# EasyEDA Pro project ProPrj_红外巡线_2025-09-12.epro

# Schematic Schematic1
Board Name: Board1; Create Date: 2025-05-07; Page Name: P1; Project Name: 红外巡线; Schematic Name: Schematic1; Update Date: 2025-05-07; Company: 嘉立创EDA; Page Size: A4; Version: V1.0
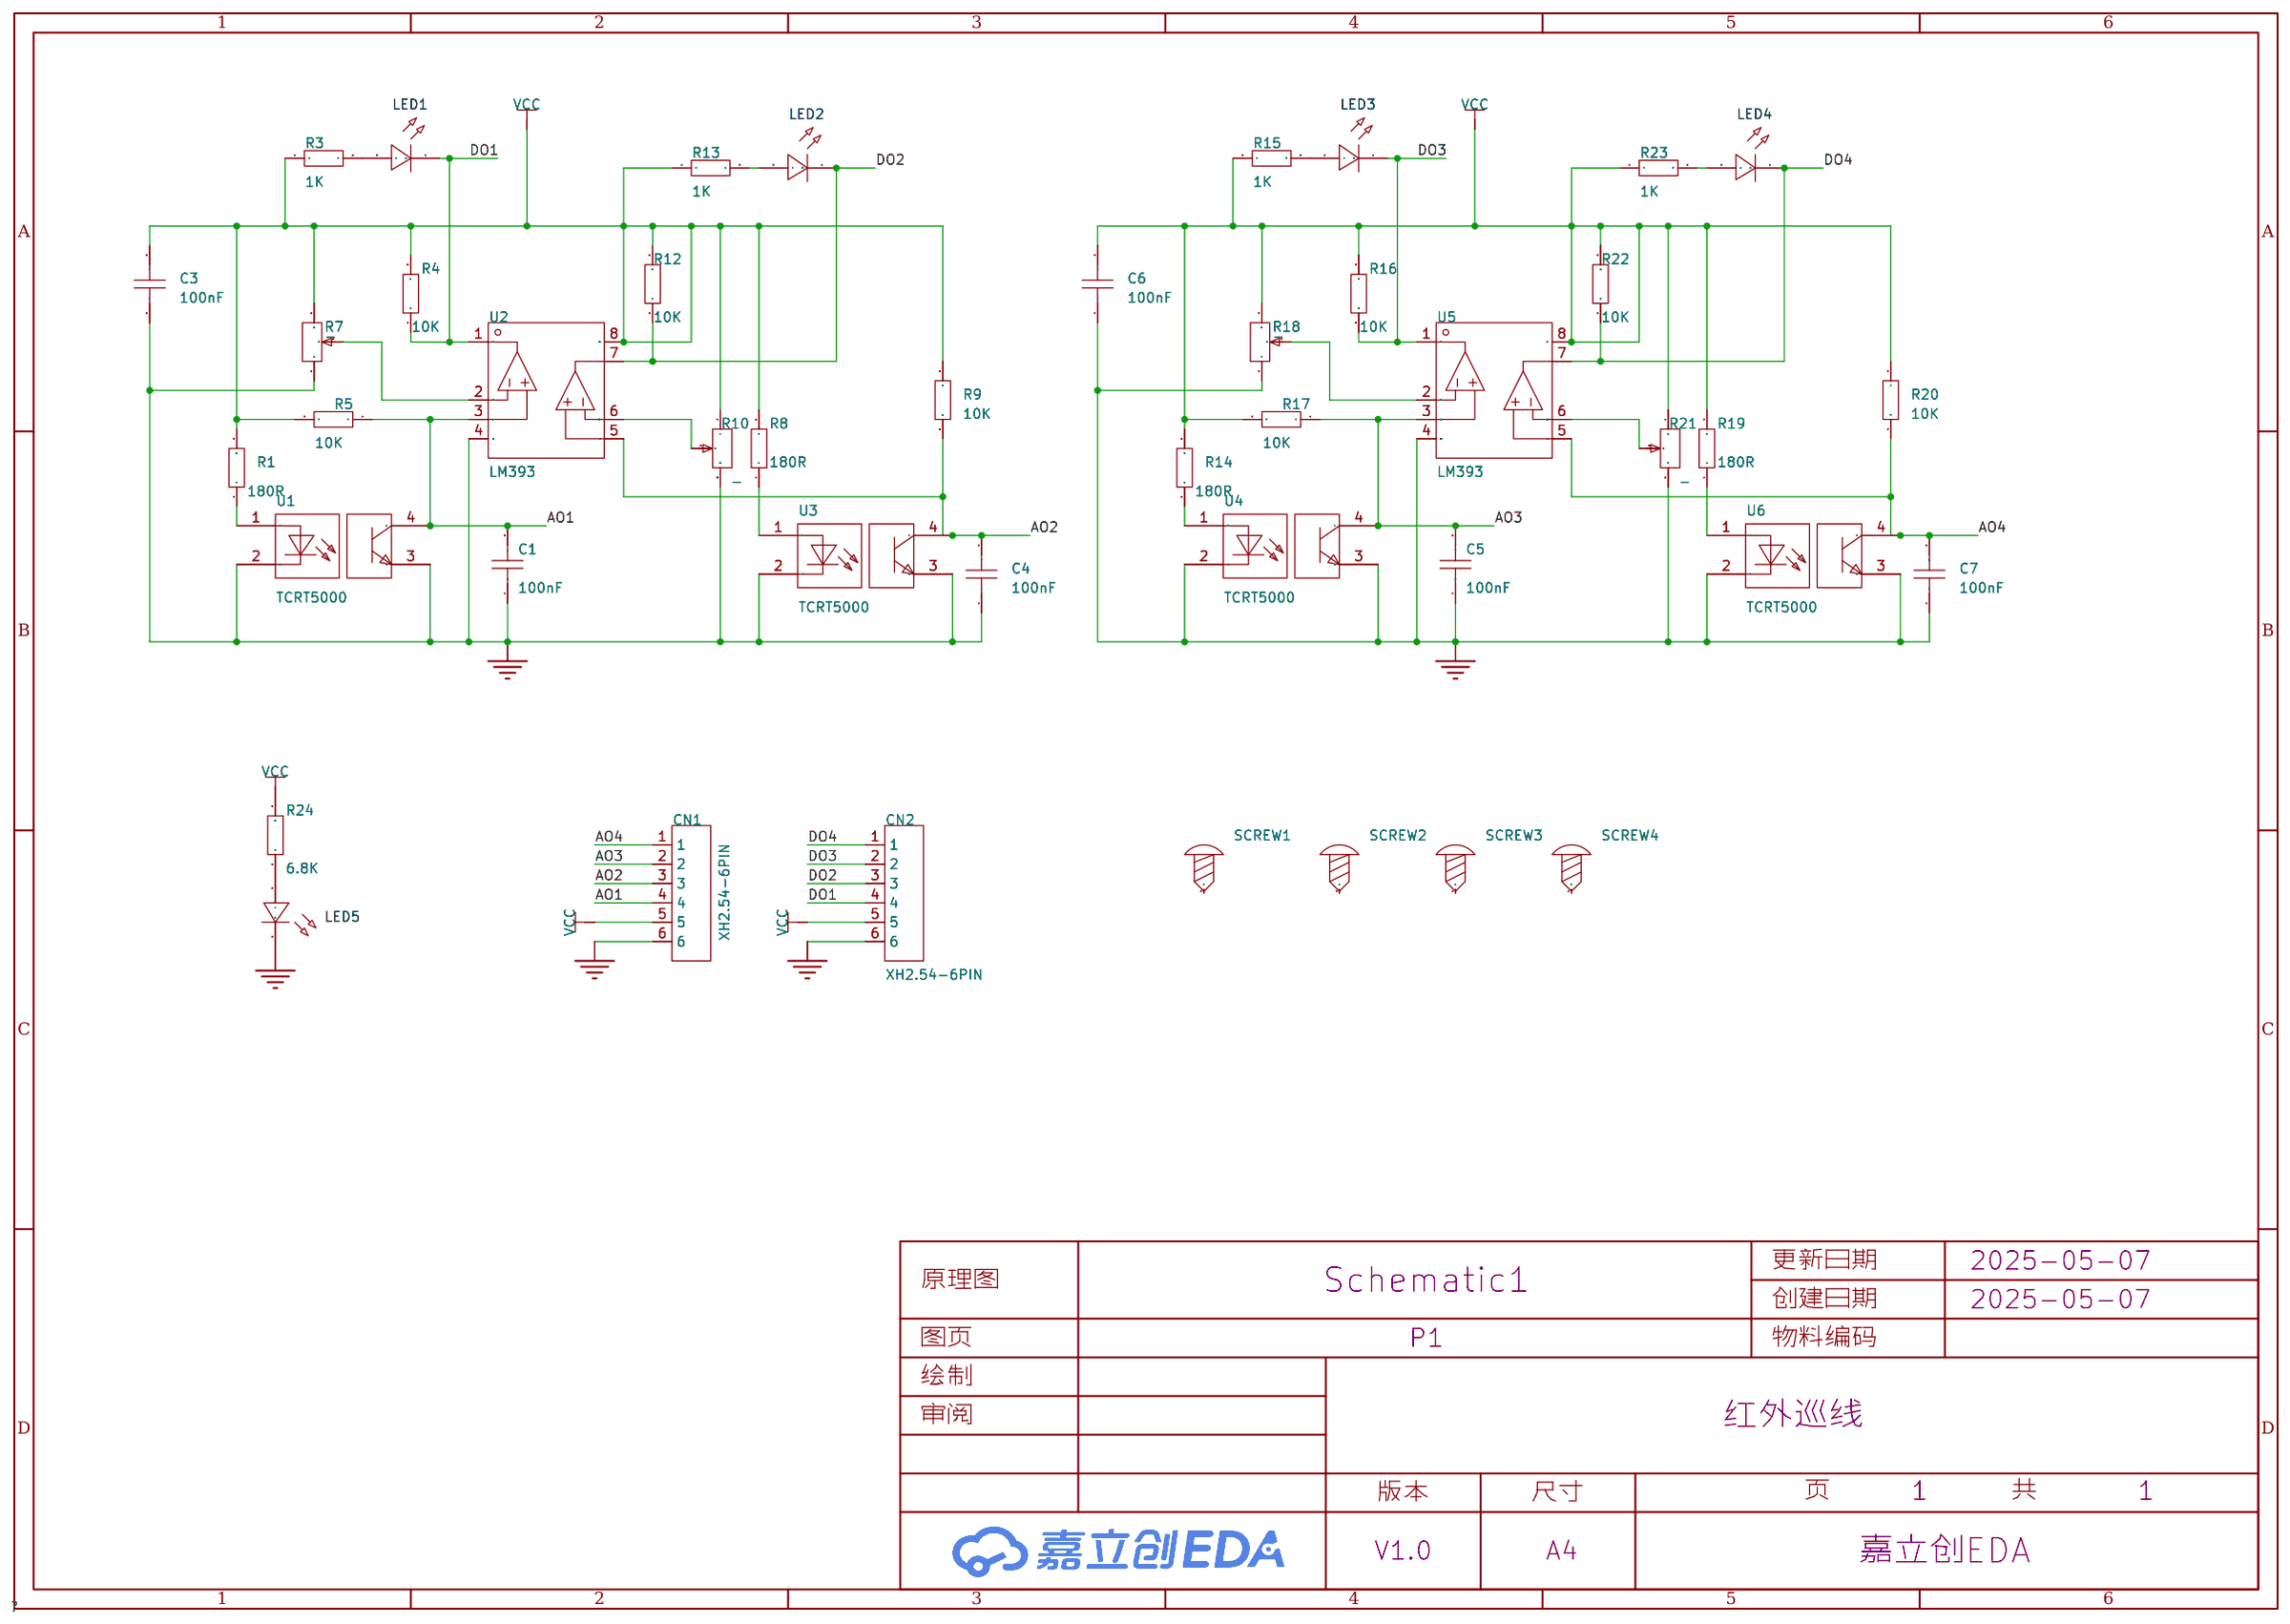
[diagram p0: schematic sheet]

## Parts
C1  100nF  [C0603]
C3  100nF  [C0603]
C4  100nF  [C0603]
C5  100nF  [C0603]
C6  100nF  [C0603]
C7  100nF  [C0603]
CN1  XH2.54-6PIN  [CONN-TH_6P-P2.50-V-M_753]
CN2  XH2.54-6PIN  [CONN-TH_6P-P2.50-V-M_753]
LED1  -  [LED_0805]
LED2  -  [LED_0805]
LED3  -  [LED_0805]
LED4  -  [LED_0805]
LED5  -  [LED_0805]
R1  180R  [R0805]
R3  1K  [R0805]
R4  10K  [R0805]
R5  10K  [R0805]
R7  -  [RES-ADJ-TH_3362P]
R8  180R  [R0805]
R9  10K  [R0805]
R10  -  [RES-ADJ-TH_3362P]
R12  10K  [R0805]
R13  1K  [R0805]
R14  180R  [R0805]
R15  1K  [R0805]
R16  10K  [R0805]
R17  10K  [R0805]
R18  -  [RES-ADJ-TH_3362P]
R19  180R  [R0805]
R20  10K  [R0805]
R21  -  [RES-ADJ-TH_3362P]
R22  10K  [R0805]
R23  1K  [R0805]
R24  6.8K  [R0805]
SCREW1  -  [M3螺丝]
SCREW2  -  [M3螺丝]
SCREW3  -  [M3螺丝]
SCREW4  -  [M3螺丝]
U1  TCRT5000  [OPTO-TH_TCRT5000]
U2  LM393  [SOP-8_L4.9-W3.9-P1.27-LS6.0-BL]
U3  TCRT5000  [OPTO-TH_TCRT5000]
U4  TCRT5000  [OPTO-TH_TCRT5000]
U5  LM393  [SOP-8_L4.9-W3.9-P1.27-LS6.0-BL]
U6  TCRT5000  [OPTO-TH_TCRT5000]

## Library data of the parts
C1 C3-C7 = CAP_0603: Supplier Footprint: 0603
CN1 CN2 = XH2.54-6PIN: Supplier Part: C9900014920; Supplier Footprint: JP6; JLCPCB Part Class: 扩展库; Supplier: LCSC
LED1-LED5 = LED_0805-G: Supplier Footprint: 0805
R1 R3-R5 R8 R9 R12-R17 R19 R20 R22-R24 = Res_0805: Supplier Footprint: 0805
R7 R10 R18 R21 = 3362P-1-103_C5047: 阻值:-;功率:-;; LCSC Part Name: 10KΩ; Supplier Part: C5047; Manufacturer Part: 3362P-1-103; Supplier Footprint: 3362P; Supplier: LCSC
SCREW1-SCREW4 = M3螺丝: Supplier Footprint: 插件
U1 U3 U4 U6 = TCRT5000: 感应距离:15mm;集电极电流(最大值):100mA;; Supplier Part: C2984661; Manufacturer: VISHAY(威世); Supplier Footprint: DIP-4; JLCPCB Part Class: 扩展库; Datasheet: https://atta.szlcsc.com/upload/public/pdf/source/20220524/56309200CFD992CFE90087BA59F1182D.pdf; Supplier: LCSC; Sensing Distance: 15mm; Collector Current (Max): 100mA
U2 U5 = LM393: Supplier Part: C504553; Supplier Footprint: SOP-8; Datasheet: https://atta.szlcsc.com/upload/public/pdf/source/20230406/A70798E4E4EECBB4A1C89323107B7C74.pdf; Supplier: LCSC

## Nets
GND: C1.1 C3.1 C4.1 C5.1 C6.1 C7.1 CN1.6 CN2.6 LED5.1(C) R7.1 R10.3 R18.1 R21.3 U1.2 U1.3 U2.4(GND) U3.2 U3.3 U4.2 U4.3 U5.4(GND) U6.2 U6.3
VCC: C3.2 C6.2 CN1.5 CN2.5 R1.2 R3.1 R4.2 R5.2 R7.3 R8.2 R9.1 R10.1 R12.2 R13.1 R14.2 R15.1 R16.2 R17.2 R18.3 R19.2 R20.1 R21.1 R22.2 R23.1 R24.2 U2.8(VDD) U5.8(VDD)
AO1: C1.2 CN1.4 R5.1 U1.4 U2.3
AO2: C4.2 CN1.3 R9.2 U2.5 U3.4
AO3: C5.2 CN1.2 R17.1 U4.4 U5.3
AO4: C7.2 CN1.1 R20.2 U5.5 U6.4
DO1: CN2.4 LED1.1(C) R4.1 U2.1
DO2: CN2.3 LED2.1(C) R12.1 U2.7
DO3: CN2.2 LED3.1(C) R16.1 U5.1
DO4: CN2.1 LED4.1(C) R22.1 U5.7
$1N605: R1.1 U1.1
$1N989: LED1.2(A) R3.2
$1N1449: LED2.2(A) R13.2
$1N1532: R8.1 U3.1
$1N2609: LED3.2(A) R15.2
$1N2632: R14.1 U4.1
$1N2644: LED4.2(A) R23.2
$1N2646: R19.1 U6.1
Net-(LED5-2): LED5.2(A) R24.1
Net-(R7-2): R7.2 U2.2
Net-(R10-2): R10.2 U2.6
Net-(R18-2): R18.2 U5.2
Net-(R21-2): R21.2 U5.6

Not connected (* = marked no-connect by the designer): SCREW1 1; SCREW2 1; SCREW3 1; SCREW4 1

# Schematic Schematic1_1
Board Name: Board1_1; Create Date: 2025-07-24; Page Name: P1; Project Name: 红外巡线; Schematic Name: Schematic1_1; Update Date: 2025-07-24; Company: 嘉立创EDA; Page Size: A4; Version: V1.0
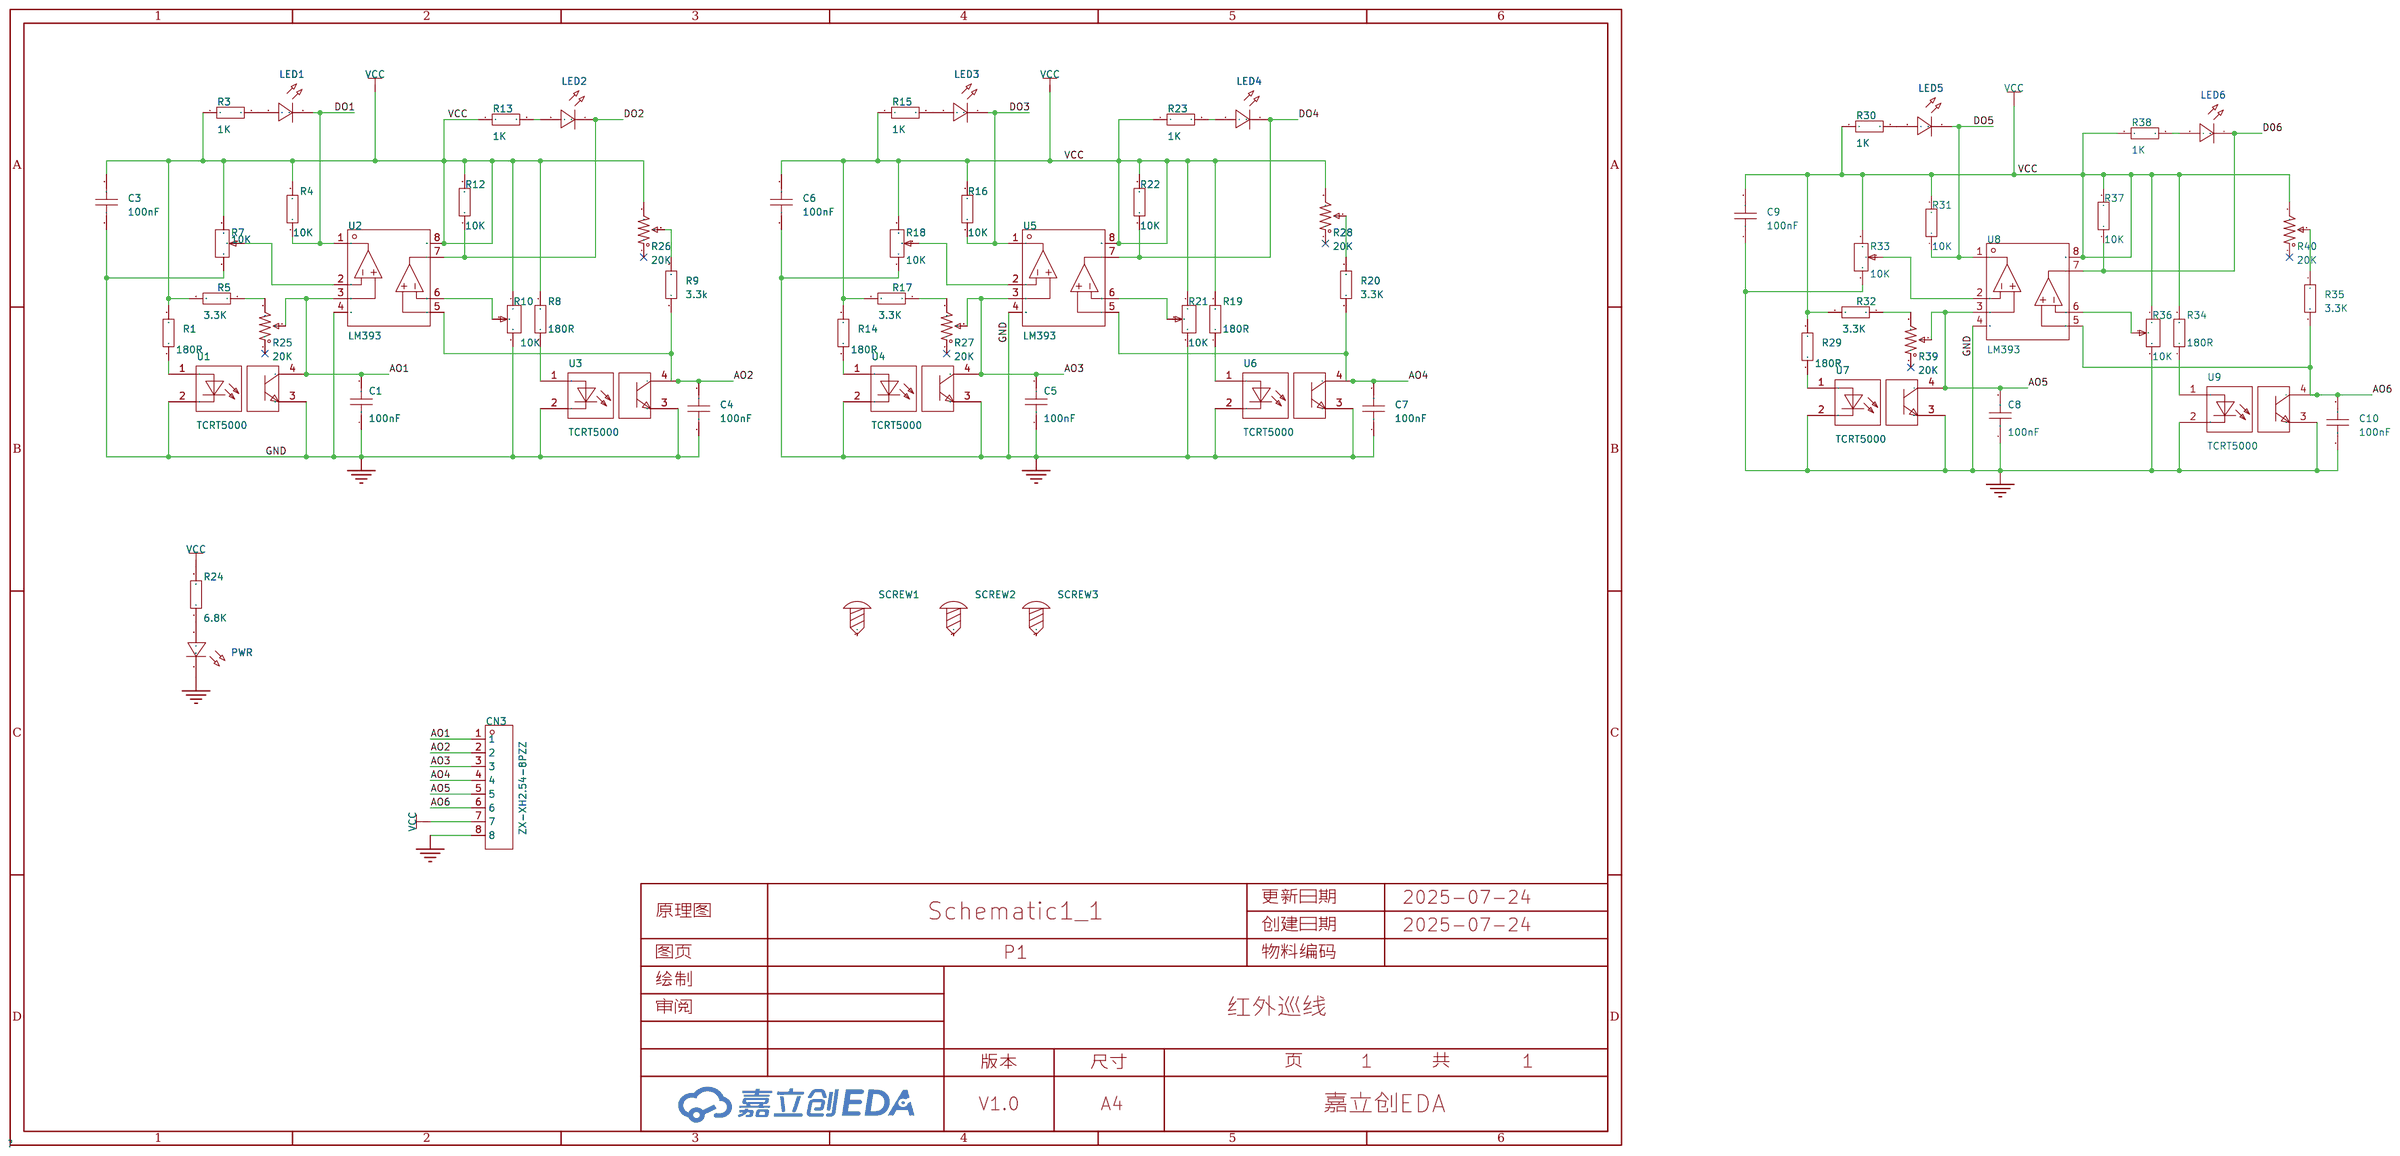
[diagram p1: schematic sheet]

## Parts
C1  100nF  [C0603]
C3  100nF  [C0603]
C4  100nF  [C0603]
C5  100nF  [C0603]
C6  100nF  [C0603]
C7  100nF  [C0603]
C8  100nF  [C0603]
C9  100nF  [C0603]
C10  100nF  [C0603]
CN3  ZX-XH2.54-8PZZ  [CONN-TH_8P-P2.50-XH2.54-8P]
LED1  -  [LED_0805]
LED2  -  [LED_0805]
LED3  -  [LED_0805]
LED4  -  [LED_0805]
LED5  -  [LED_0805]
LED6  -  [LED_0805]
PWR  -  [LED_0805]
R1  180R  [R0805]
R3  1K  [R0805]
R4  10K  [R0805]
R5  3.3K  [R0805]
R7  10K  [RES-ADJ-TH_3362P]
R8  180R  [R0805]
R9  3.3k  [R0805]
R10  10K  [RES-ADJ-TH_3362P]
R12  10K  [R0805]
R13  1K  [R0805]
R14  180R  [R0805]
R15  1K  [R0805]
R16  10K  [R0805]
R17  3.3K  [R0805]
R18  10K  [RES-ADJ-TH_3362P]
R19  180R  [R0805]
R20  3.3K  [R0805]
R21  10K  [RES-ADJ-TH_3362P]
R22  10K  [R0805]
R23  1K  [R0805]
R24  6.8K  [R0805]
R25  20K  [RES-ADJ-TH_3P-L10.0-W10.0-P2.50-L]
R26  20K  [RES-ADJ-TH_3P-L10.0-W10.0-P2.50-L]
R27  20K  [RES-ADJ-TH_3P-L10.0-W10.0-P2.50-L]
R28  20K  [RES-ADJ-TH_3P-L10.0-W10.0-P2.50-L]
R29  180R  [R0805]
R30  1K  [R0805]
R31  10K  [R0805]
R32  3.3K  [R0805]
R33  10K  [RES-ADJ-TH_3362P]
R34  180R  [R0805]
R35  3.3K  [R0805]
R36  10K  [RES-ADJ-TH_3362P]
R37  10K  [R0805]
R38  1K  [R0805]
R39  20K  [RES-ADJ-TH_3P-L10.0-W10.0-P2.50-L]
R40  20K  [RES-ADJ-TH_3P-L10.0-W10.0-P2.50-L]
SCREW1  -  [M3螺丝]
SCREW2  -  [M3螺丝]
SCREW3  -  [M3螺丝]
U1  TCRT5000  [OPTO-TH_TCRT5000]
U2  LM393  [SOP-8_L4.9-W3.9-P1.27-LS6.0-BL]
U3  TCRT5000  [OPTO-TH_TCRT5000]
U4  TCRT5000  [OPTO-TH_TCRT5000]
U5  LM393  [SOP-8_L4.9-W3.9-P1.27-LS6.0-BL]
U6  TCRT5000  [OPTO-TH_TCRT5000]
U7  TCRT5000  [OPTO-TH_TCRT5000]
U8  LM393  [SOP-8_L4.9-W3.9-P1.27-LS6.0-BL]
U9  TCRT5000  [OPTO-TH_TCRT5000]

## Library data of the parts
C1 C3-C10 = CAP_0603: Supplier Footprint: 0603
CN3 = ZX-XH2.54-8PZZ: 插针结构:1x8P;间距:2.5mm;安装方式:直插;参考系列:XH;总PIN数:8P;排数:1;每排PIN数:8;行距:-;额定电流:3A;触头材质:黄铜;触头镀层:锡;工作温度:-25℃~+85℃;; LCSC Part Name: 1x8P 间距:2.5mm 直插 系列:XH; Supplier Part: C7429638; Manufacturer: Megastar(兆星); Supplier Footprint: 插件,P=2.5mm; JLCPCB Part Class: 扩展库; Datasheet: https://atta.szlcsc.com/upload/public/pdf/source/20230619/688603DEA58996C00B1F33C46797D2C3.pdf; Supplier: LCSC; Pins Structure: 1x8P; Pitch: 2.5mm; Mounting Type: 直插; Reference Series: XH; Number of Pins: 8P; Number of Rows: 1; Number of PINs Per Row: 8; Current Rating: 3A; Contact Material: 黄铜; Contact Plating: 锡; Operating Temperature: -25℃~+85℃; Voltage Rating: 250V; Plastic Material: PA66; Flame Retardant Rating: UL94V-0; Color: 白色; Z-Height of the Board: 7mm; X-Length of Bottom Edge on Board (Spacing Line): 22.5mm; Y-Width of Bottom Edge on Board: 5.9mm
LED1-LED6 PWR = LED_0805-G: Supplier Footprint: 0805
R1 R3-R5 R8 R9 R12-R17 R19 R20 R22-R24 R29-R32 R34 R35 R37 R38 = Res_0805: Supplier Footprint: 0805
R7 R10 R18 R21 R33 R36 = 3362P-1-103_C5047: 阻值:-;功率:-;; LCSC Part Name: 10KΩ; Supplier Part: C5047; Manufacturer Part: 3362P-1-103; Supplier Footprint: 3362P; Supplier: LCSC
R25-R28 R39 R40 = 3296W-1-103: 阻值:10kΩ;精度:±10%;; LCSC Part Name: 10kΩ ±10%; Supplier Part: C118954; Manufacturer: BOCHEN(博晨); Supplier Footprint: 插件; JLCPCB Part Class: 扩展库; Datasheet: https://atta.szlcsc.com/upload/public/pdf/source/20171114/C118954_15106326646611117443.pdf; Supplier: LCSC; Tolerance: ±10%
SCREW1-SCREW3 = M3螺丝: Supplier Footprint: 插件
U1 U3 U4 U6 U7 U9 = TCRT5000: 感应距离:15mm;集电极电流(最大值):100mA;; Supplier Part: C2984661; Manufacturer: VISHAY(威世); Supplier Footprint: DIP-4; JLCPCB Part Class: 扩展库; Datasheet: https://atta.szlcsc.com/upload/public/pdf/source/20220524/56309200CFD992CFE90087BA59F1182D.pdf; Supplier: LCSC; Sensing Distance: 15mm; Collector Current (Max): 100mA
U2 U5 U8 = LM393: Supplier Part: C504553; Supplier Footprint: SOP-8; Datasheet: https://atta.szlcsc.com/upload/public/pdf/source/20230406/A70798E4E4EECBB4A1C89323107B7C74.pdf; Supplier: LCSC

## Nets
GND: C1.1 C3.1 C4.1 C5.1 C6.1 C7.1 C8.1 C9.1 C10.1 CN3.8 PWR.1(C) R7.1 R10.3 R18.1 R21.3 R33.1 R36.3 U1.2 U1.3 U2.4(GND) U3.2 U3.3 U4.2 U4.3 U5.4(GND) U6.2 U6.3 U7.2 U7.3 U8.4(GND) U9.2 U9.3
VCC: C3.2 C6.2 C9.2 CN3.7 R1.2 R3.1 R4.2 R5.2 R7.3 R8.2 R10.1 R12.2 R13.1 R14.2 R15.1 R16.2 R17.2 R18.3 R19.2 R21.1 R22.2 R23.1 R24.2 R26.3 R28.3 R29.2 R30.1 R31.2 R32.2 R33.3 R34.2 R36.1 R37.2 R38.1 R40.3 U2.8(VDD) U5.8(VDD) U8.8(VDD)
AO1: C1.2 CN3.1 R25.2 U1.4 U2.3
AO2: C4.2 CN3.2 R9.2 U2.5 U3.4
AO3: C5.2 CN3.3 R27.2 U4.4 U5.3
AO4: C7.2 CN3.4 R20.2 U5.5 U6.4
AO5: C8.2 CN3.5 R39.2 U7.4 U8.3
AO6: C10.2 CN3.6 R35.2 U8.5 U9.4
D06: LED6.1(C) R37.1 U8.7
DO1: LED1.1(C) R4.1 U2.1
DO2: LED2.1(C) R12.1 U2.7
DO3: LED3.1(C) R16.1 U5.1
DO4: LED4.1(C) R22.1 U5.7
DO5: LED5.1(C) R31.1 U8.1
$1N605: R1.1 U1.1
$1N940: R7.2 U2.2
$1N989: LED1.2(A) R3.2
$1N1449: LED2.2(A) R13.2
$1N1532: R8.1 U3.1
$1N1671: R10.2 U2.6
$1N2568: R18.2 U5.2
$1N2609: LED3.2(A) R15.2
$1N2632: R14.1 U4.1
$1N2634: R21.2 U5.6
$1N2644: LED4.2(A) R23.2
$1N2646: R19.1 U6.1
$1N2763: PWR.2(A) R24.1
$1N4726: R5.1 R25.3
$1N4783: R9.1 R26.2
$1N4874: R17.1 R27.3
$1N4929: R20.1 R28.2
$1N5568: R29.1 U7.1
$1N5570: R33.2 U8.2
$1N5571: LED5.2(A) R30.2
$1N5574: LED6.2(A) R38.2
$1N5575: R34.1 U9.1
$1N5578: R36.2 U8.6
$1N5589: R32.1 R39.3
$1N5591: R35.1 R40.2

Not connected (* = marked no-connect by the designer): R25 1*; R26 1*; R27 1*; R28 1*; R39 1*; R40 1*; SCREW1 1; SCREW2 1; SCREW3 1

# Board PCB1
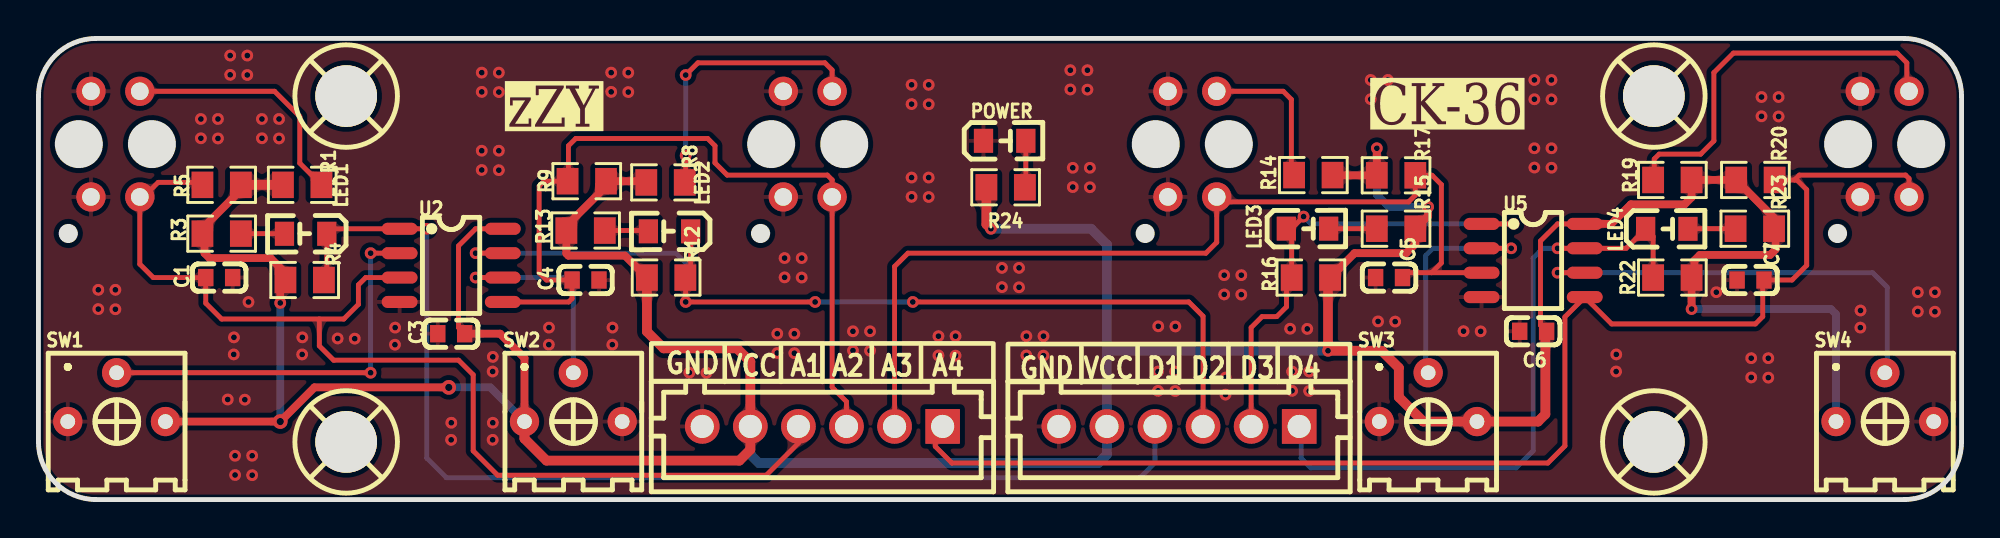
[diagram p2: board, top side]
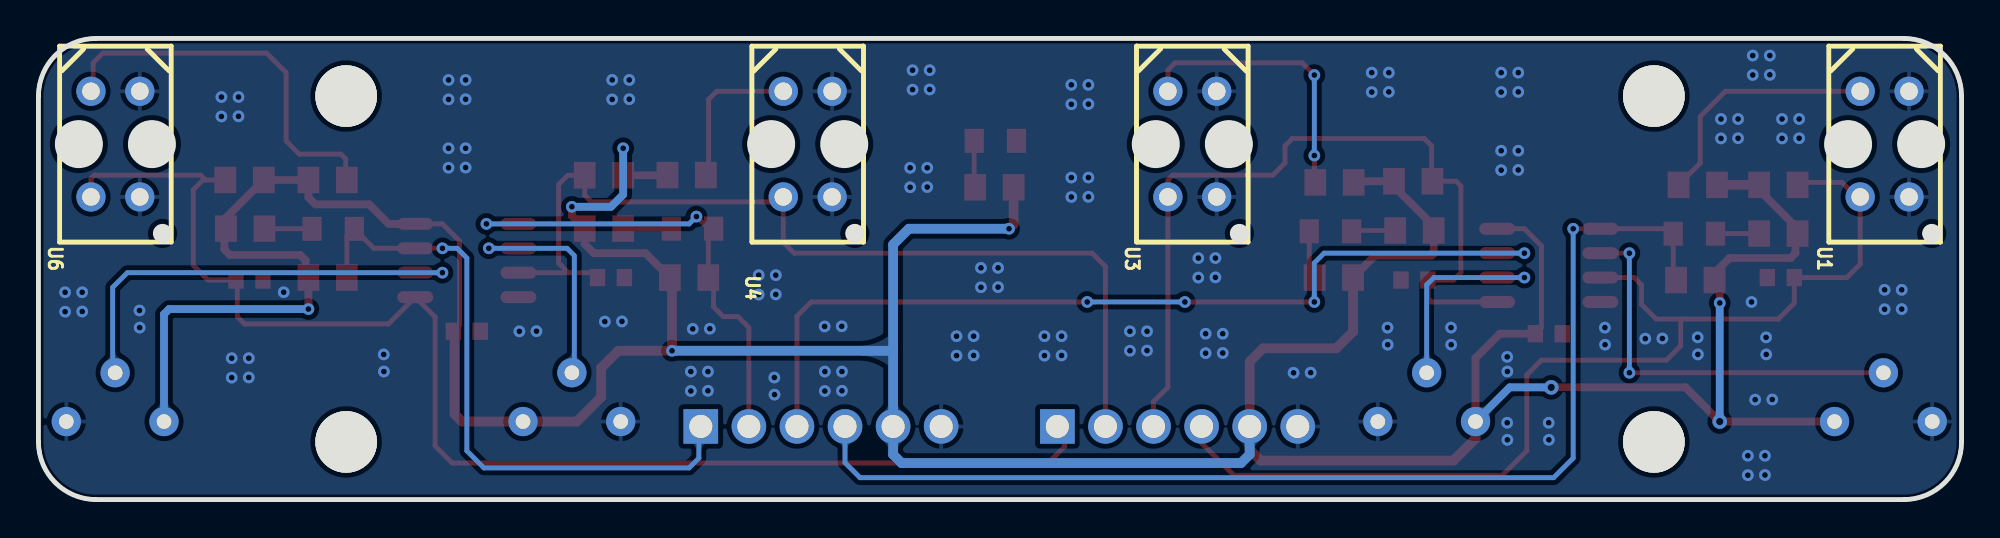
[diagram p3: board, bottom side, seen from below]

Outline 100 x 24 mm; copper layers: Top Layer, Bottom Layer. Coordinates in mm from the lower left corner of the outline.
Outline path: 0,21 0,3 arc(0.88,0.88) 3,0 97,0 arc(99.12,0.88) 100,3 100,21 arc(99.12,23.12) 97,24 3,24 arc(0.88,23.12) 0,21
Stack: Top Layer 0.035mm / Dielectric1 1.51mm FR4 er 4.5 / Bottom Layer 0.035mm

## Design rules (mm)
template: JLCPCB Capability(Two Layers Board)
spacing copperThickness1oz (default): track to track 0.102, other pairs 0.152 to 0.3
spacing copperThickness2oz: track to track 0.203, other pairs 0.152 to 0.3
track width copperThickness1oz (default): min 0.127, default 0.254, max 2.54
track width copperThickness2oz: min 0.203, default 0.254, max 2.54
differential pair differentialPair (default): width min 0.127, default 0.254, max 2.54; gap min 0.152, default 0.152
via viaSize (default): diameter min 0.5, default 0.61, max 10; hole min 0.3, default 0.305, max 6.3

## Placement (name value [footprint] x y rotation side)
AO  XH2.54-6PIN  [CONN-TH_6P-P2.50-V-M_753]  40.77 3.81 180 top
C1  100nF  [C0603]  9.4 11.55 180 top
C3  100nF  [C0603]  21.46 8.63 0 top
C4  100nF  [C0603]  28.45 11.43 180 top
C5  100nF  [C0603]  70.23 11.55 0 top
C6  100nF  [C0603]  77.72 8.76 0 top
C7  100nF  [C0603]  89.03 11.43 0 top
DO  XH2.54-6PIN  [CONN-TH_6P-P2.50-V-M_753]  59.31 3.81 180 top
LED1  -  [LED_0805]  13.84 13.84 180 top
LED2  -  [LED_0805]  32.77 13.97 180 top
LED3  -  [LED_0805]  66.04 14.09 0 top
LED4  -  [LED_0805]  84.72 14.08 0 top
POWER  -  [LED_0805]  50.29 18.67 0 top
R1  180R  [R0805]  13.72 16.38 180 top
R3  1K  [R0805]  9.53 13.84 0 top
R4  10K  [R0805]  13.84 11.43 180 top
R5  10K  [R0805]  9.53 16.38 0 top
R8  180R  [R0805]  32.61 16.51 180 top
R9  10K  [R0805]  28.51 16.57 180 top
R12  10K  [R0805]  32.64 11.55 180 top
R13  1K  [R0805]  28.45 14 0 top
R14  180R  [R0805]  66.29 16.89 0 top
R15  1K  [R0805]  70.6 14.1 180 top
R16  10K  [R0805]  66.17 11.55 0 top
R17  10K  [R0805]  70.6 16.88 180 top
R19  180R  [R0805]  84.96 16.63 0 top
R20  10K  [R0805]  89.28 16.63 0 top
R22  10K  [R0805]  84.96 11.55 0 top
R23  1K  [R0805]  89.25 14.1 180 top
R24  6.8K  [R0805]  50.29 16.25 180 top
SCREW1  -  [M3螺丝]  84 21 0 top
SCREW2  -  [M3螺丝]  84 3 0 top
SCREW3  -  [M3螺丝]  16 21 0 top
SCREW4  -  [M3螺丝]  16 3 0 top
SW1  -  [RES-ADJ-TH_3362P]  4.06 5.33 0 top
SW2  -  [RES-ADJ-TH_3362P]  27.81 5.33 0 top
SW3  -  [RES-ADJ-TH_3362P]  72.26 5.33 0 top
SW4  -  [RES-ADJ-TH_3362P]  96.01 5.33 0 top
U1  TCRT5000  [OPTO-TH_TCRT5000]  4 18.5 90 bottom
U2  LM393  [SOP-8_L4.9-W3.9-P1.27-LS6.0-BL]  21.46 12.19 270 top
U3  TCRT5000  [OPTO-TH_TCRT5000]  40 18.5 90 bottom
U4  TCRT5000  [OPTO-TH_TCRT5000]  60 18.5 90 bottom
U5  LM393  [SOP-8_L4.9-W3.9-P1.27-LS6.0-BL]  77.72 12.44 270 top
U6  TCRT5000  [OPTO-TH_TCRT5000]  96 18.5 90 bottom

## Footprints (pads in the part's own frame, mm; a bottom-side part is the same pattern mirrored in y, then rotated)
C0603
  rect 0.8x0.9 smd: 1(-0.7,0) 2(0.7,0)
CONN-TH_6P-P2.50-V-M_753
  rect 1.8x1.8 hole 1.2: 1(-6.25,0)
  round 1.8 hole 1.2: 2(-3.75,0) 3(-1.25,0) 4(1.25,0) 5(3.75,0) 6(6.25,0)
LED_0805
  rect 1x1.25 smd: 1(-1.15,0.005) 2(1.05,0.005)
M3螺丝
  round 3.2 hole 3.2: 1(0,0)
OPTO-TH_TCRT5000
  round 1.524 hole 0.914: 1(2.75,1.27) 2(2.75,-1.27) 3(-2.75,-1.27) 4(-2.75,1.27)
R0805
  rect 1.133x1.377 smd: 1(-1,0) 2(1,0)
RES-ADJ-TH_3362P
  round 1.524 hole 0.762: 1(-2.54,-1.27) 2(0,1.27) 3(2.54,-1.27)
SOP-8_L4.9-W3.9-P1.27-LS6.0-BL
  oval 0.63x1.865 smd: 1(-1.905,-2.683) 2(-0.635,-2.683) 3(0.635,-2.683) 4(1.905,-2.683) 5(1.905,2.683) 6(0.635,2.683) 7(-0.635,2.683) 8(-1.905,2.683)

## Nets
GND: AO.6 C1.1 C3.1 C4.1 C5.1 C6.1 C7.1 DO.6 POWER.1 SW1.1 SW2.3 SW3.1 SW4.3 U1.2 U1.3 U2.4 U3.2 U3.3 U4.2 U4.3 U5.4 U6.2 U6.3
VCC: AO.5 C3.2 C6.2 DO.5 R1.2 R3.1 R4.2 R5.2 R8.2 R9.1 R12.2 R13.1 R14.2 R15.1 R16.2 R17.2 R19.2 R20.1 R22.2 R23.1 R24.2 SW1.3 SW2.1 SW3.3 SW4.1 U2.8 U5.8
AO1: AO.4 C1.2 R5.1 U1.4 U2.3
AO2: AO.3 C4.2 R9.2 U2.5 U3.4
AO3: AO.2 C5.2 R17.1 U4.4 U5.3
AO4: AO.1 C7.2 R20.2 U5.5 U6.4
DO1: DO.4 LED1.1 R4.1 U2.1
DO2: DO.3 LED2.1 R12.1 U2.7
DO3: DO.2 LED3.1 R16.1 U5.1
DO4: DO.1 LED4.1 R22.1 U5.7
$1N605: R1.1 U1.1
$1N940: SW1.2 U2.2
$1N989: LED1.2 R3.2
$1N1449: LED2.2 R13.2
$1N1532: R8.1 U3.1
$1N1671: SW2.2 U2.6
$1N2568: SW3.2 U5.2
$1N2609: LED3.2 R15.2
$1N2632: R14.1 U4.1
$1N2634: SW4.2 U5.6
$1N2644: LED4.2 R23.2
$1N2646: R19.1 U6.1
$1N2763: POWER.2 R24.1

Pads without a net: SCREW1 1; SCREW2 1; SCREW3 1; SCREW4 1

## Via types
v1: diameter 0.762, hole 0.381, Top Layer to Bottom Layer, 2 vias
v2: diameter 0.61, hole 0.305, Top Layer to Bottom Layer, 167 vias

## Routing (per net, layer and track width the routed paths; a pad name or vN(x,y) marks a point on that pad's centre or on a via; arc(x,y) is an arc through that point)
GND:
  vias: v2(3.11,10.92) v2(3.11,9.91) v2(4,10.92) v2(4,9.91) v2(8.45,19.81) v2(8.45,18.8) v2(9.33,19.81) v2(9.33,18.8) v2(9.84,5.21) v2(9.97,23.11) v2(9.97,22.11) v2(10.16,8.44) v2(10.16,7.55) v2(10.22,2.28) v2(10.22,1.28) v2(10.73,5.2) v2(10.86,23.11) v2(10.86,22.1) v2(10.92,10.28) v2(11.11,2.28) v2(11.11,1.27) v2(11.62,19.81) v2(11.62,18.8) v2(12.51,19.81) v2(12.51,18.8) v2(13.72,8.44) v2(13.71,7.55) v2(15.56,8.38) v2(16.45,8.37) v2(18.55,8.95) v2(18.54,8.06) v2(21.47,4) v2(21.46,3.11) v2(23.05,22.22) v2(23.05,21.22) v2(23.05,18.16) v2(23.05,17.15) v2(23.63,7.43) v2(23.62,6.66) v2(23.63,4) v2(23.62,3.11) v2(23.94,22.22) v2(23.94,21.21) v2(23.94,18.16) v2(23.94,17.14) v2(26.55,8.95) v2(26.54,8.06) v2(29.78,22.22) v2(29.78,21.22) v2(29.85,8.95) v2(29.84,8.06) v2(30.67,22.22) v2(30.67,21.21) v2(33.85,6.61) v2(34.73,6.6) v2(38.42,8.63) v2(38.42,7.63) v2(38.8,12.57) v2(38.8,11.56) v2(39.31,8.63) v2(39.31,7.62) v2(39.69,12.57) v2(39.69,11.56) v2(42.35,8.76) v2(42.35,7.75) v2(43.24,8.76) v2(43.24,7.75) v2(45.4,21.58) v2(45.4,20.58) v2(45.4,16.76) v2(45.4,15.76) v2(46.29,21.58) v2(46.29,20.57) v2(46.29,16.76) v2(46.29,15.75) v2(46.8,8.5) v2(46.8,7.5) v2(47.69,8.5) v2(47.69,7.49) v2(50.1,12.06) v2(50.1,11.06) v2(50.99,12.06) v2(50.99,11.05) v2(51.37,8.5) v2(51.37,7.5) v2(52.26,8.5) v2(52.26,7.49) v2(53.66,22.35) v2(53.66,21.34) v2(53.78,17.27) v2(53.78,16.26) v2(54.55,22.35) v2(54.55,21.33) v2(54.67,17.27) v2(54.67,16.25) v2(58.23,9.02) v2(58.22,6.66) v2(58.22,5.66) v2(59.12,9.01) v2(59.11,6.66) v2(59.11,5.65) v2(61.66,11.68) v2(61.66,10.68) v2(61.74,6.35) v2(61.73,5.46) v2(62.55,11.68) v2(62.55,10.67) v2(65.09,8.89) v2(65.19,6.66) v2(65.19,5.66) v2(65.98,8.88) v2(66.08,6.66) v2(66.08,5.65) v2(69.28,21.84) v2(69.28,20.84) v2(69.66,9.27) v2(70.17,21.84) v2(70.17,20.83) v2(70.55,9.26) v2(74.1,8.76) v2(74.99,8.76) v2(77.79,21.84) v2(77.79,20.84) v2(77.79,18.28) v2(77.79,17.28) v2(78.68,21.84) v2(78.68,20.83) v2(78.68,18.28) v2(78.68,17.27) v2(82.05,7.55) v2(82.04,6.66) v2(87.25,10.79) v2(89.06,7.36) v2(89.06,6.36) v2(89.6,20.95) v2(89.6,19.95) v2(89.95,7.36) v2(89.95,6.35) v2(90.49,20.95) v2(90.49,19.94) v2(94.75,9.84) v2(94.74,8.95) v2(97.73,10.79) v2(97.73,9.79) v2(98.62,10.79) v2(98.62,9.78)
VCC: length 223.3
  Top Layer w0.254: U2.8 22.73,14.09 21.84,13.2 21.84,8.95 C3.2 ; C6.2 78.1,9.08 78.1,13.46 78.99,14.35 U5.8
  Top Layer w0.406: R17.2 67.31,16.88 R14.2 ; v2(72.26,15.24) 72.26,14.77 R15.1 71.6,13.3 71.12,12.82 68.44,12.82 R16.2 ; v2(69.6,18.28) 69.6,16.88 ; R8.2 31.54,16.57 R9.1 29.51,16.3 27.45,14.24 R13.1 27.45,12.81 27.56,12.7 30.5,12.7 R12.2 ; v2(85.96,9.92) R22.2 86.11,11.7 86.11,12.44 86.39,12.73 90.04,12.73 90.33,13.02 90.33,14.02 R23.1 90.25,14.66 R20.1 R19.2 85.96,15.73 85.6,15.36 82.8,15.36 81.79,14.35 U5.8 ; SW1.3 v1(12.57,4.06) 14.35,5.84 v1(21.34,5.84) ; v2(12.57,10.23) 12.57,11.16 R4.2 12.84,11.79 12.06,12.57 8.89,12.57 8.64,12.82 8.64,13.73 R3.1 8.53,14.11 10.53,16.11 R5.2 ; C3.2 24,8.63 25.27,7.36 SW2.1
  Top Layer w0.508: C6.2 78.36,8.69 78.36,4.44 77.98,4.06 SW3.3 72.01,4.06 70.74,5.33 70.74,6.86 69.85,7.74 v2(67.06,7.74) 67.06,11.44 R16.2 ; R5.2 R1.2 ; v2(49.53,14.09) 49.29,14.33 R24.2 ; SW2.1 25.27,3.17 26.42,2.03 36.45,2.03 37.02,2.6 AO.5 37.02,7.18 36.32,7.87 32.51,7.87 31.64,8.74 R12.2
  Bottom Layer w0.406: v1(21.34,5.84) 23.5,5.84 SW2.1 ; v2(85.96,9.92) 93.21,9.92 93.47,9.65 SW4.1 ; v1(12.57,4.06) v2(12.57,10.23) ; v2(69.6,18.28) 69.6,15.87 70.23,15.24 v2(72.26,15.24)
  Bottom Layer w0.508: AO.5 37.02,2.35 37.47,1.9 55.12,1.9 55.56,2.34 DO.5 55.56,7.74 ; 55.56,7.74 55.56,13.27 54.74,14.09 v2(49.53,14.09) ; 55.56,7.74 55.56,7.74 v2(67.06,7.74)
AO1: length 57.1
  Top Layer w0.254: 14.61,9.39 14.61,8 15.35,7.26 21.84,7.26 22.61,6.49 22.61,2.54 23.88,1.27 37.85,1.27 39.52,2.94 AO.4 ; 14.61,9.39 15.88,9.39 16.64,10.16 16.64,11.17 17.02,11.55 U2.3 ; 14.61,9.39 9.53,9.39 8.7,10.22 C1.2 8.62,11.63 8.55,11.55 5.97,11.55 5.27,12.25 U1.4 5.47,15.75 6.22,16.51 8.4,16.51 R5.1
AO2: length 42.9
  Top Layer w0.254: U2.5 27.57,10.28 27.75,10.46 C4.2 26.42,11.43 26.03,11.81 26.03,16.32 26.29,16.57 R9.2 27.56,16.62 27.56,18.41 27.94,18.79 34.8,18.79 35.18,18.41 35.18,17.52 35.81,16.89 41.02,16.89 41.27,16.64 U3.4 41.27,5.84 42.02,5.1 AO.3
AO3: length 50.1
  Top Layer w0.254: 72.44,11.81 71.19,11.81 70.93,11.55 ; 72.44,11.81 U5.3 ; 72.44,11.81 72.95,12.32 72.95,16.4 72.47,16.88 R17.1 71.6,15.84 71.25,15.49 61.53,15.49 U4.4 61.27,13.39 60.71,12.82 45.21,12.82 44.52,12.13 AO.2
AO4: length 70.2
  Top Layer w0.254: AO.1 46.64,3.43 46.64,2.76 47.5,1.9 78.49,1.9 79.38,2.79 79.38,9.51 U5.5 81.8,9.14 89.28,9.14 89.66,9.52 89.66,11.36 89.73,11.43 91.19,11.43 91.95,12.19 91.95,16.13 91.44,16.63 91.31,16.63 ; 91.31,16.63 R20.2 ; 91.31,16.63 91.57,16.89 97.09,16.89 97.27,16.71 U6.4
DO1: length 60.2
  Top Layer w0.254: R4.1 14.99,11.58 14.99,13.83 15.25,14.09 U2.1 v2(20.19,14.09)
  Bottom Layer w0.254: DO.4 58.06,1.92 57.28,1.14 21.21,1.14 20.19,2.16 v2(20.19,14.09)
DO2: length 51.3
  Top Layer w0.254: v2(45.47,10.28) 59.82,10.28 60.56,9.54 DO.3 ; LED2.1 33.92,11.83 R12.1 33.66,11.54 v2(33.66,10.28) v2(40.39,10.28) ; v2(22.73,12.82) U2.7
  Bottom Layer w0.254: v2(22.73,12.82) 33.15,12.82 33.66,12.32 v2(33.66,10.28) ; v2(40.39,10.28) v2(45.47,10.28)
DO3: length 25.6
  Top Layer w0.254: DO.2 63.06,8.95 63.63,9.52 64.39,9.52 64.9,10.03 64.9,11.28 R16.1 65.17,13.82 64.89,14.1 65.16,14.1 v2(65.79,14.73) ; U5.1 v2(76.71,14.35)
  Bottom Layer w0.254: v2(76.71,14.35) 66.17,14.35 v2(65.79,14.73)
DO4: length 33.5
  Top Layer w0.254: R22.1 83.96,13.7 LED4.1 82.56,13.08 U5.7 v2(78.99,13.08)
  Bottom Layer w0.254: v2(78.99,13.08) 78.23,13.08 77.72,12.57 77.72,2.54 76.84,1.65 66.17,1.65 65.66,2.16 65.66,3.71 DO.1
$1N605: length 12.9
  Top Layer w0.254: U1.1 12.28,21.25 13.59,19.94 13.59,17.51 R1.1
$1N940: length 20.9
  Top Layer w0.254: v2(17.27,12.82) U2.2 ; SW1.2 v2(17.27,6.6)
  Bottom Layer w0.254: v2(17.27,6.6) v2(17.27,12.82)
$1N989: length 2.3
  Top Layer w0.254: R3.2 12.79,13.84 LED1.2
$1N1449: length 2.3
  Top Layer w0.254: R13.2 31.68,14 LED2.2
$1N1532: length 14.3
  Top Layer w0.254: U3.1 41.27,22.35 40.89,22.73 34.29,22.73 v2(33.66,22.09) ; 33.53,17.02 33.66,17.14 v2(33.66,17.9)
  Bottom Layer w0.254: v2(33.66,22.09) v2(33.66,17.9)
$1N1671: length 11.2
  Top Layer w0.254: U2.6 v2(22.73,11.55)
  Bottom Layer w0.254: v2(22.73,11.55) 27.43,11.55 27.81,11.17 SW2.2
$1N2568: length 12.3
  Top Layer w0.254: U5.2 v2(76.58,13.08)
  Bottom Layer w0.254: SW3.2 72.14,6.73 72.14,12.7 72.52,13.08 v2(76.58,13.08)
$1N2609: length 2.5
  Top Layer w0.254: 67.09,14.1 69.59,14.1
$1N2632: length 8.1
  Top Layer w0.254: U4.1 64.73,21.25 65.15,20.83 65.15,17.03 R14.1
$1N2634: length 23.4
  Top Layer w0.254: U5.6 v2(78.99,11.81)
  Bottom Layer w0.254: SW4.2 96.14,6.73 96.14,11.05 95.38,11.81 v2(78.99,11.81)
$1N2644: length 2.5
  Top Layer w0.254: LED4.2 85.78,14.1 R23.2
$1N2646: length 20.4
  Top Layer w0.254: U6.1 97.16,21.36 97.16,22.73 96.65,23.24 88.14,23.24 87.12,22.22 87.12,18.67 86.43,17.98 84.28,17.98 84.02,17.72 84.02,16.69 R19.1
$1N2763: length 2.4
  Top Layer w0.254: 51.34,18.67 51.34,16.3 R24.1

## Copper pours and planes (outline as drawn; the poured copper is in the pictures)
GND on Top Layer: -30.61,55.24 103.76,55.24 103.76,-4.96 -30.61,-4.96
GND on Bottom Layer: -7.87,27.05 122.3,27.05 122.3,-24.9 -7.87,-24.9

Small or netless copper shapes (teardrops, artwork), in the pictures only: 145 on Top Layer, 34 on Bottom Layer

## Text on the board
Top Silkscreen Layer: GND | VCC | A1 | A2 | A3 | A4 | D1 | D2 | D3 | D4 | zZY | CK-36

# Board PCB1_1
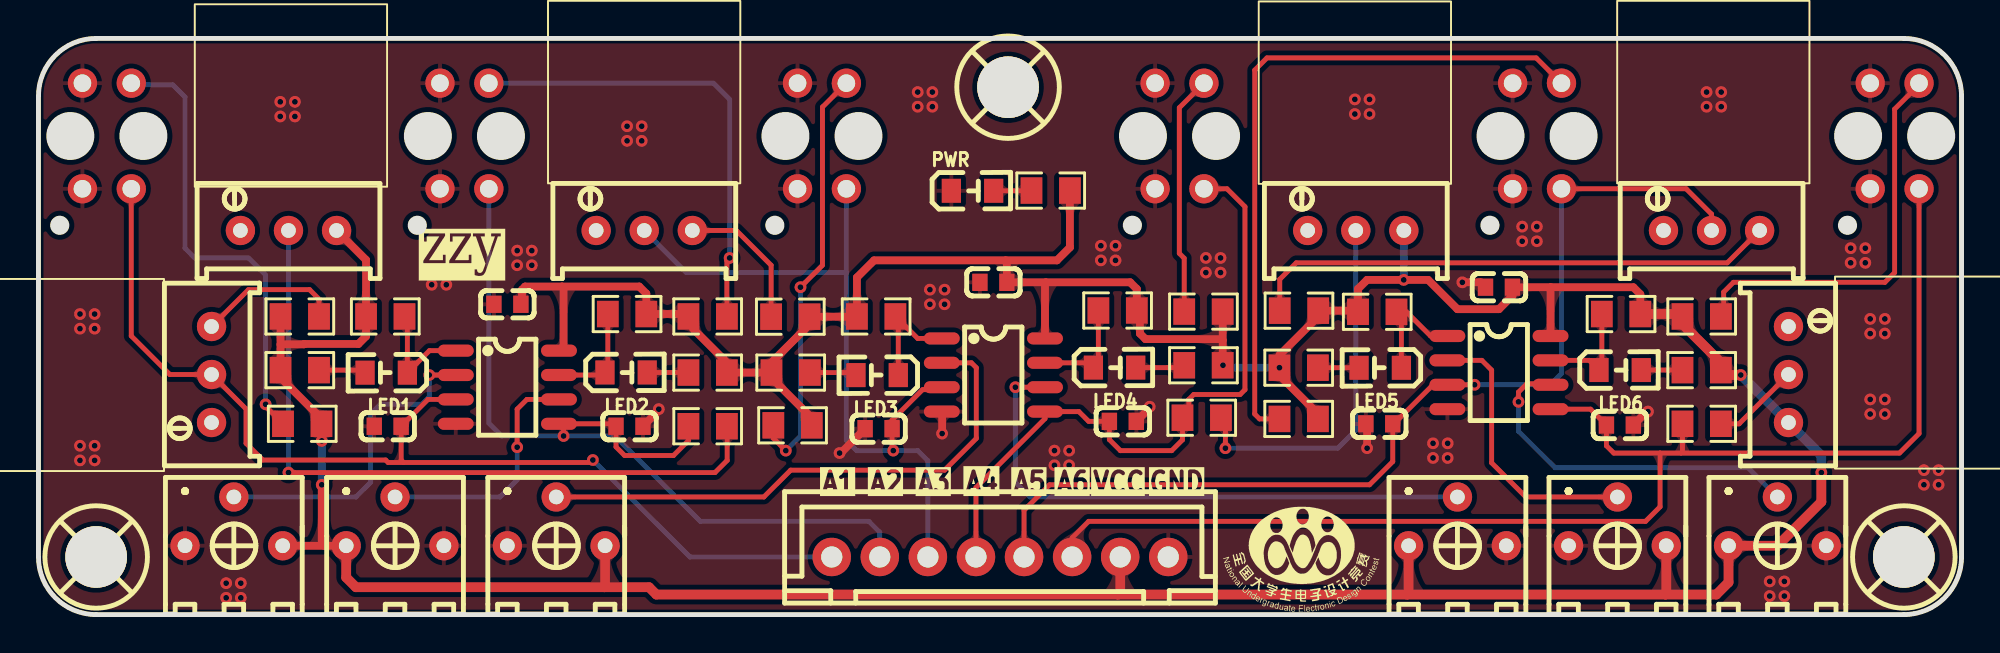
[diagram p4: board, top side]
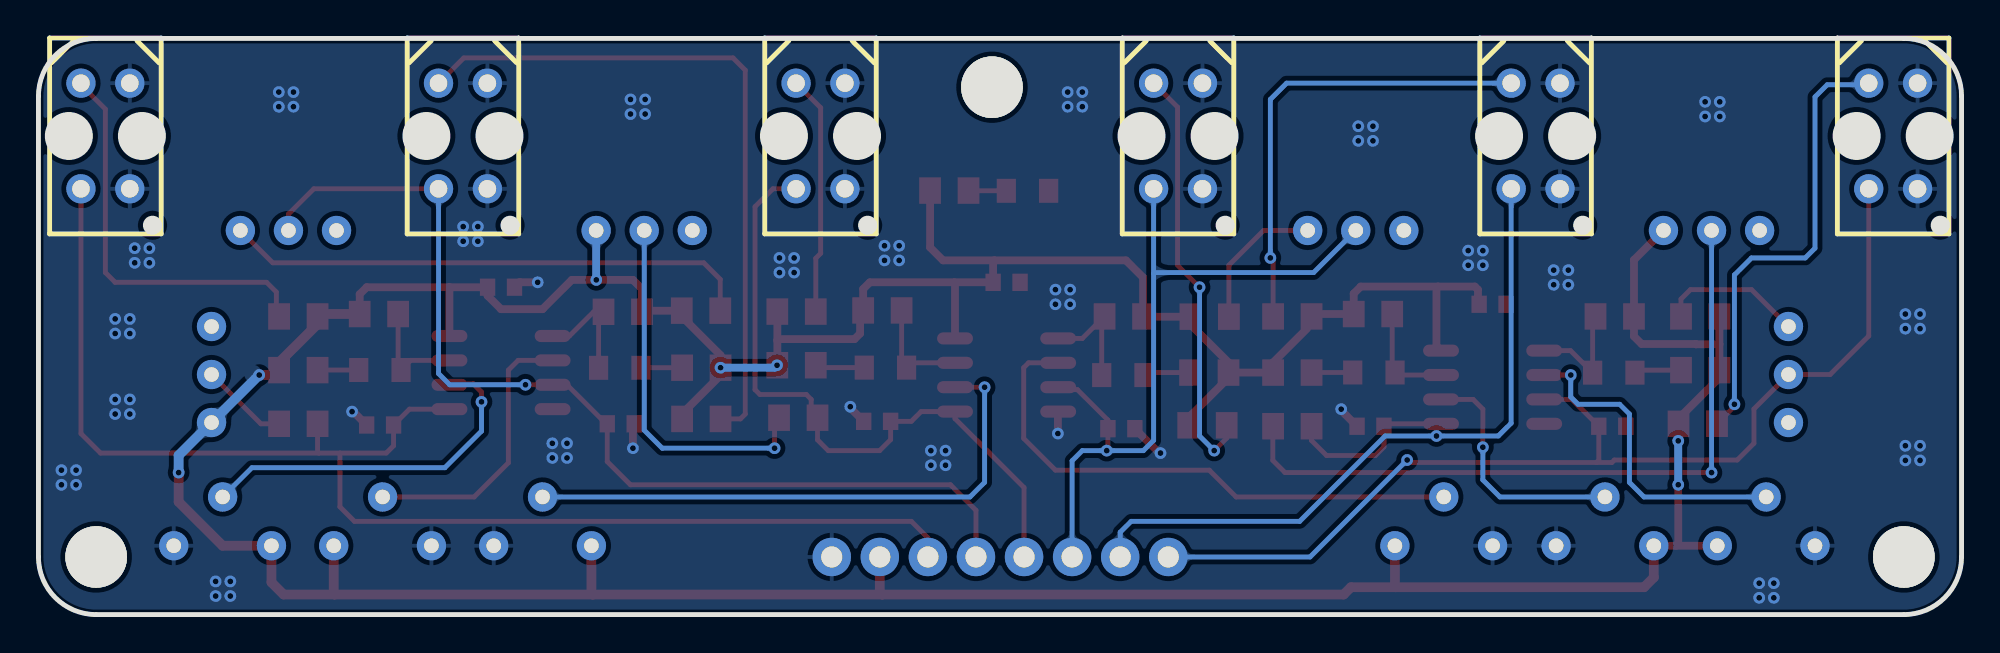
[diagram p5: board, bottom side, seen from below]

Outline 100 x 30 mm; copper layers: Top Layer, Bottom Layer. Coordinates in mm from the lower left corner of the outline.
Outline path: 0,27 0,3 arc(0.88,0.88) 3,0 97,0 arc(99.12,0.88) 100,3 100,27 arc(99.12,29.12) 97,30 3,30 arc(0.88,29.12) 0,27
Stack: Top Layer 0.035mm / Dielectric1 1.51mm FR4 er 4.5 / Bottom Layer 0.035mm

## Design rules (mm)
template: JLCPCB Capability(Two Layers Board)
spacing copperThickness1oz (default): track to track 0.102, other pairs 0.152 to 0.3
spacing copperThickness2oz: track to track 0.203, other pairs 0.152 to 0.3
track width copperThickness1oz (default): min 0.127, default 0.254, max 2.54
track width copperThickness2oz: min 0.203, default 0.254, max 2.54
differential pair differentialPair (default): width min 0.127, default 0.254, max 2.54; gap min 0.152, default 0.152
via viaSize (default): diameter min 0.5, default 0.61, max 10; hole min 0.3, default 0.305, max 6.3

## Placement (name value [footprint] x y rotation side)
C1  100nF  [C0603]  18.16 9.81 0 top
C3  100nF  [C0603]  24.38 16.16 0 top
C4  100nF  [C0603]  30.73 9.81 180 top
C5  100nF  [C0603]  43.69 9.68 0 top
C6  100nF  [C0603]  49.66 17.3 0 top
C7  100nF  [C0603]  56.39 10.06 180 top
C8  100nF  [C0603]  69.72 9.93 0 top
C9  100nF  [C0603]  75.95 17.05 0 top
C10  100nF  [C0603]  82.23 9.87 180 top
CN3  ZX-XH2.54-8PZZ  [CONN-TH_8P-P2.50-XH2.54-8P]  50 3 180 top
LED1  -  [LED_0805]  18.03 12.6 180 top
LED2  -  [LED_0805]  30.61 12.6 0 top
LED3  -  [LED_0805]  43.56 12.47 180 top
LED4  -  [LED_0805]  56.01 12.86 0 top
LED5  -  [LED_0805]  69.72 12.86 180 top
LED6  -  [LED_0805]  82.3 12.73 0 top
PWR  -  [LED_0805]  48.62 22.06 0 top
R1  180R  [R0805]  13.72 9.93 0 top
R3  1K  [R0805]  13.59 12.73 0 top
R4  10K  [R0805]  18.03 15.52 180 top
R5  3.3K  [R0805]  13.59 15.52 180 top
R7  10K  [RES-ADJ-TH_3362P]  10.16 4.85 0 top
R8  180R  [R0805]  34.8 15.52 180 top
R9  3.3k  [R0805]  34.8 9.81 180 top
R10  10K  [RES-ADJ-TH_3362P]  18.54 4.85 0 top
R12  10K  [R0805]  30.61 15.65 0 top
R13  1K  [R0805]  34.8 12.6 180 top
R14  180R  [R0805]  39.21 9.86 0 top
R15  1K  [R0805]  39.12 12.6 0 top
R16  10K  [R0805]  43.56 15.52 180 top
R17  3.3K  [R0805]  39.1 15.51 0 top
R18  10K  [RES-ADJ-TH_3362P]  26.92 4.85 0 top
R19  180R  [R0805]  60.58 15.78 0 top
R20  3.3K  [R0805]  60.49 10.25 180 top
R21  10K  [RES-ADJ-TH_3362P]  73.79 4.85 0 top
R22  10K  [R0805]  56.12 15.83 0 top
R23  1K  [R0805]  60.58 12.98 180 top
R24  6.8K  [R0805]  52.64 22.08 0 top
R25  20K  [RES-ADJ-TH_3P-L10.0-W10.0-P2.50-L]  9 12.5 90 top
R26  20K  [RES-ADJ-TH_3P-L10.0-W10.0-P2.50-L]  13 20 0 top
R27  20K  [RES-ADJ-TH_3P-L10.0-W10.0-P2.50-L]  31.5 20 0 top
R28  20K  [RES-ADJ-TH_3P-L10.0-W10.0-P2.50-L]  68.5 20 0 top
R29  180R  [R0805]  65.53 10.19 0 top
R30  1K  [R0805]  65.53 12.86 0 top
R31  10K  [R0805]  69.62 15.77 180 top
R32  3.3K  [R0805]  65.55 15.82 0 top
R33  10K  [RES-ADJ-TH_3362P]  82.11 4.85 0 top
R34  180R  [R0805]  86.49 15.52 180 top
R35  3.3K  [R0805]  86.49 9.93 180 top
R36  10K  [RES-ADJ-TH_3362P]  90.42 4.85 0 top
R37  10K  [R0805]  82.3 15.65 0 top
R38  1K  [R0805]  86.49 12.73 180 top
R39  20K  [RES-ADJ-TH_3P-L10.0-W10.0-P2.50-L]  87 20 0 top
R40  20K  [RES-ADJ-TH_3P-L10.0-W10.0-P2.50-L]  91 12.5 270 top
SCREW1  -  [M3螺丝]  3 3 0 top
SCREW2  -  [M3螺丝]  50.42 27.46 0 top
SCREW3  -  [M3螺丝]  97 3 0 top
U1  TCRT5000  [OPTO-TH_TCRT5000]  3.56 24.92 90 bottom
U2  LM393  [SOP-8_L4.9-W3.9-P1.27-LS6.0-BL]  24.38 11.84 270 top
U3  TCRT5000  [OPTO-TH_TCRT5000]  22.15 24.92 90 bottom
U4  TCRT5000  [OPTO-TH_TCRT5000]  40.74 24.92 90 bottom
U5  LM393  [SOP-8_L4.9-W3.9-P1.27-LS6.0-BL]  49.66 12.47 270 top
U6  TCRT5000  [OPTO-TH_TCRT5000]  59.33 24.92 90 bottom
U7  TCRT5000  [OPTO-TH_TCRT5000]  77.93 24.92 90 bottom
U8  LM393  [SOP-8_L4.9-W3.9-P1.27-LS6.0-BL]  75.95 12.6 270 top
U9  TCRT5000  [OPTO-TH_TCRT5000]  96.52 24.92 90 bottom

## Footprints (pads in the part's own frame, mm; a bottom-side part is the same pattern mirrored in y, then rotated)
C0603
  rect 0.8x0.9 smd: 1(-0.7,0) 2(0.7,0)
CONN-TH_8P-P2.50-XH2.54-8P
  round 2 hole 1.1: 1(8.75,0) 2(6.25,0) 3(3.75,0) 4(1.25,0) 5(-1.25,0) 6(-3.75,0) 7(-6.25,0) 8(-8.75,0)
LED_0805
  rect 1x1.25 smd: 1(-1.15,0.005) 2(1.05,0.005)
M3螺丝
  round 3.2 hole 3.2: 1(0,0)
OPTO-TH_TCRT5000
  round 1.524 hole 0.914: 1(2.75,1.27) 2(2.75,-1.27) 3(-2.75,-1.27) 4(-2.75,1.27)
R0805
  rect 1.133x1.377 smd: 1(-1,0) 2(1,0)
RES-ADJ-TH_3P-L10.0-W10.0-P2.50-L
  round 1.524 hole 0.762: 1(-2.5,0) 2(0,0) 3(2.5,0)
RES-ADJ-TH_3362P
  round 1.524 hole 0.762: 1(-2.54,-1.27) 2(0,1.27) 3(2.54,-1.27)
SOP-8_L4.9-W3.9-P1.27-LS6.0-BL
  oval 0.63x1.865 smd: 1(-1.905,-2.683) 2(-0.635,-2.683) 3(0.635,-2.683) 4(1.905,-2.683) 5(1.905,2.683) 6(0.635,2.683) 7(-0.635,2.683) 8(-1.905,2.683)

## Nets
As in the schematic.

Pads without a net: R25 1; R26 1; R27 1; R28 1; R39 1; R40 1; SCREW1 1; SCREW2 1; SCREW3 1

## Via types
v1: diameter 0.61, hole 0.305, Top Layer to Bottom Layer, 112 vias

## Routing (per net, layer and track width the routed paths; a pad name or vN(x,y) marks a point on that pad's centre or on a via; arc(x,y) is an arc through that point)
GND: length 8.9
  Top Layer w0.406: C5.1 41.72,8.41 v1(41.66,8.41) ; C10.1 83.63,10.57 v1(83.69,10.57) ; v1(74.04,17.3) 74.99,17.3 C9.1 ; C7.1 57.78,10.76 v1(57.78,10.82) ; C8.1 69.09,9.87 v1(69.09,8.66) ; U5.4 46.99,10.55 v1(46.99,9.43) ; C4.1 32.26,10.63 v1(32.26,10.7)
  vias: v1(2.16,15.65) v1(2.16,14.89) v1(2.16,8.79) v1(2.16,8.03) v1(2.92,15.65) v1(2.92,14.89) v1(2.92,8.79) v1(2.92,8.03) v1(9.76,1.64) v1(9.76,0.87) v1(10.52,1.64) v1(10.52,0.87) v1(12.57,26.7) v1(12.57,25.94) v1(13.33,26.7) v1(13.33,25.94) v1(20.45,17.94) v1(20.45,17.17) v1(21.21,17.94) v1(21.21,17.17) v1(24.89,18.95) v1(24.89,18.19) v1(25.65,18.95) v1(25.65,18.19) v1(30.61,25.43) v1(30.61,24.67) v1(31.37,25.43) v1(31.37,24.67) v1(45.72,27.21) v1(45.72,26.44) v1(46.35,16.92) v1(46.35,16.16) v1(46.48,27.21) v1(46.48,26.44) v1(47.12,16.92) v1(47.12,16.16) v1(52.83,8.54) v1(52.83,7.78) v1(53.59,8.54) v1(53.59,7.78) v1(55.25,19.2) v1(55.25,18.44) v1(56.01,19.2) v1(56.01,18.44) v1(60.71,18.57) v1(60.71,17.81) v1(61.47,18.57) v1(61.47,17.81) v1(68.45,26.83) v1(68.45,26.06) v1(69.22,26.83) v1(69.22,26.06) v1(72.52,8.92) v1(72.52,8.16) v1(73.28,8.92) v1(73.28,8.16) v1(77.15,20.2) v1(77.15,19.44) v1(77.91,20.2) v1(77.91,19.44) v1(86.74,27.21) v1(86.74,26.44) v1(87.5,27.21) v1(87.5,26.44) v1(90.02,1.73) v1(90.02,0.97) v1(90.79,1.73) v1(90.79,0.97) v1(94.23,19.08) v1(94.23,18.32) v1(95,19.08) v1(95,18.32) v1(95.25,15.39) v1(95.25,14.63) v1(95.25,11.2) v1(95.25,10.44) v1(96.01,15.39) v1(96.01,14.63) v1(96.01,11.2) v1(96.01,10.44) v1(98.04,7.52) v1(98.04,6.76) v1(98.81,7.52) v1(98.81,6.76)
VCC: length 236.3
  Top Layer w0.406: 34.04,14.89 35.8,13.12 R13.1 R15.1 ; C3.2 25.15,16.22 25.15,16.92 25.31,17.08 27.23,17.08 ; 78.63,17.05 78.63,17.04 U8.8 ; 78.63,17.05 82.93,17.05 83.3,16.68 R37.2 ; 78.63,17.05 C9.2 76.65,16.6 75.95,15.9 73.79,15.9 72.26,17.43 v1(70.99,17.43) 69.09,17.43 68.62,16.96 R31.2 68.56,15.82 R32.2 66.55,15.52 64.53,13.51 v1(64.53,12.86) 64.53,12.46 66.53,10.46 R29.2 ; 12.59,14.07 13.81,14.07 13.83,14.09 16.64,14.09 17.03,14.49 R4.2 17.03,18.47 R26.3 ; 12.59,14.07 R3.1 12.59,12.33 14.72,10.2 R1.2 14.72,9.06 v1(14.73,9.05) ; 12.59,14.07 R5.2 ; 52.38,17.3 52.34,17.26 U5.8 ; 52.38,17.3 56.77,17.3 57.12,16.95 R22.2 57.28,15.67 57.28,14.63 57.56,14.35 61.51,14.35 61.58,14.28 ; 52.38,17.3 C6.2 50.36,18.39 50.3,18.44 ; v1(14.73,6.76) 14.73,3.7 14.84,3.58 ; 50.3,18.44 52.96,18.44 53.64,19.12 R24.2 ; 50.3,18.44 43.45,18.44 42.56,17.55 R16.2 42.55,15.51 R17.2 40.1,15.11 38.12,13.12 R15.1 ; 27.23,17.08 27.31,17 27.31,13.98 U2.8 ; 27.23,17.08 31.24,17.08 31.61,16.71 R12.2 33.67,15.65 R8.2 ; R15.1 38.12,12.33 40.21,10.23 R14.2 ; v1(61.59,12.98) R23.1 61.58,14.28 ; R19.2 61.58,14.28 ; R10.1 14.84,3.58 ; 14.84,3.58 R7.3
  Top Layer w0.508: v1(88.52,12.47) 87.74,12.47 R38.1 87.49,13.12 85.49,15.12 R34.2 85.36,15.65 R37.2 ; v1(92.71,7.39) 92.71,5.87 90.42,3.58 R36.1 87.88,1.68 87.25,1.04 84.6,1.04 ; R18.3 29.46,1.46 29.43,1.42 ; 56.13,1.04 56.25,1.17 CN3.7 ; 56.13,1.04 32.13,1.04 31.75,1.42 29.43,1.42 ; 56.13,1.04 71.17,1.04 ; 84.6,1.04 71.17,1.04 ; 84.6,1.04 84.65,1.08 R33.3 ; 29.43,1.42 16.51,1.42 16,1.93 R10.1 ; R21.1 71.25,1.12 71.17,1.04
  Bottom Layer w0.406: v1(14.73,9.05) v1(14.73,6.76) ; v1(64.53,12.86) 61.72,12.86 v1(61.59,12.98) ; v1(70.99,17.43) 71,17.43 R28.3
  Bottom Layer w0.508: v1(88.52,12.47) 88.53,12.47 R40.3 92.71,8.29 v1(92.71,7.39)
AO1: length 55.4
  Top Layer w0.254: U2.3 20.26,11.2 C1.2 18.86,8.04 18.98,7.92 ; 18.98,7.92 28.7,7.92 v1(28.83,8.05) ; 18.98,7.92 18.18,7.92 18.05,8.05 11.66,8.05 10.8,8.92 10.8,10.7 R25.2 6.83,12.5 4.83,14.51 U1.4
  Bottom Layer w0.254: CN3.1 33.88,3 v1(28.83,8.05)
AO2: length 46
  Top Layer w0.254: v1(27.31,9.3) 27.31,9.7 U2.5 29.91,9.93 C4.2 30.03,8.73 30.48,8.28 33.02,8.28 33.8,9.06 R9.2
  Bottom Layer w0.254: CN3.2 43.75,4.28 43.18,4.85 34.42,4.85 29.97,9.3 v1(27.31,9.3) 24.09,9.3 23.42,9.97 U3.4
AO3: length 39.1
  Top Layer w0.254: U5.3 46.85,11.71 45.97,11.71 44.39,10.13 C5.2 44.39,8.6 v1(44.45,8.54)
  Bottom Layer w0.254: R27.2 33.69,17.81 41.97,17.81 42.01,17.77 ; CN3.3 46.25,8.01 45.72,8.54 v1(44.45,8.54) 42.54,8.54 42.01,9.07 42.01,17.77 ; 42.01,17.77 U4.4
AO4: length 35.3
  Top Layer w0.254: U6.4 61.81,22.17 62.74,21.24 62.74,11.71 62.48,11.46 60.07,11.46 59.82,11.2 59.82,10.58 R20.2 59.49,9.1 58.93,8.54 56.26,8.54 55.69,9.11 C7.2 54.61,10.06 54.1,10.57 U5.5 52.34,10.2 48.75,6.61 CN3.4
AO5: length 53.3
  Top Layer w0.254: U7.4 85.68,22.17 87,20.85 R39.2 ; CN3.5 51.25,5.43 52.58,6.76 69.22,6.76 70.42,7.97 C8.2 70.49,9.93 72.52,11.97 U8.3 v1(74.68,11.97)
  Bottom Layer w0.254: v1(74.68,11.97) 78.61,11.97 79.2,12.55 U7.4
AO6: length 70.5
  Top Layer w0.254: CN3.6 53.75,3.99 54.61,4.85 83.57,4.85 84.32,5.61 84.32,8.41 ; U9.4 97.79,9.43 96.77,8.41 85.42,8.41 ; U8.5 80.71,10.7 C10.2 81.53,8.79 81.91,8.41 84.32,8.41 ; 85.42,8.41 85.49,8.48 R35.2 ; 85.42,8.41 84.32,8.41
D06: length 5.7
  Top Layer w0.254: R37.1 81.3,12.88 LED6.1 80.64,13.24 U8.7
DO1: length 6
  Top Layer w0.254: U2.1 20.33,13.74 LED1.1 19.18,15.37 R4.1
DO2: length 5.6
  Top Layer w0.254: R12.1 29.61,12.76 LED2.1 29.32,12.47 U2.7
DO3: length 6
  Top Layer w0.254: U5.1 45.72,14.38 44.58,15.52 R16.1 44.71,15.37 44.71,12.47
DO4: length 5.7
  Top Layer w0.254: 52.34,13.11 54.61,13.11 LED4.1 55.12,13.12 R22.1
DO5: length 6.2
  Top Layer w0.254: U8.1 72.39,14.51 71.13,15.77 R31.1 70.87,15.51 70.87,12.85
$1N605: length 23.9
  Top Layer w0.254: v1(11.81,10.95) 11.81,10.84 R1.1
  Bottom Layer w0.254: U1.1 4.91,27.59 6.98,27.59 7.62,26.95 7.62,19.08 8.13,18.57 10.92,18.57 11.81,17.68 v1(11.81,10.95)
$1N940: length 16.9
  Top Layer w0.254: v1(20.32,12.47) U2.2
  Bottom Layer w0.254: v1(20.32,12.47) 20.32,11.33 19.94,10.95 17.78,10.95 17.27,10.44 17.27,6.89 16.51,6.12 R7.2
$1N989: length 2.4
  Top Layer w0.254: R3.2 16.85,12.73 LED1.2
$1N1449: length 2.1
  Top Layer w0.254: LED2.2 33.79,12.61 R13.2
$1N1532: length 24.2
  Top Layer w0.254: v1(35.94,18.57) 35.8,18.43 R8.1
  Bottom Layer w0.254: v1(35.94,18.57) 35.94,26.83 35.1,27.67 U3.1
$1N1671: length 12.8
  Top Layer w0.254: v1(24.89,8.72) 24.89,10.7 25.4,11.2 U2.6
  Bottom Layer w0.254: R10.2 24,6.12 24.89,7.01 v1(24.89,8.72)
$1N2568: length 28.7
  Top Layer w0.254: R18.2 37.72,6.12 39.12,7.52 47.12,7.52 48.77,9.17 48.77,12.86 48.51,13.11 46.97,13.11
$1N2609: length 2.4
  Top Layer w0.254: 42.51,12.47 42.38,12.6 R15.2
$1N2632: length 22
  Top Layer w0.254: v1(39.62,17.05) 40.77,18.19 40.77,26.43 U4.1 ; v1(38.86,8.54) 38.21,9.19 R14.1
  Bottom Layer w0.254: v1(39.62,17.05) 39.62,9.3 v1(38.86,8.54)
$1N2634: length 29.8
  Top Layer w0.254: U5.6 v1(50.8,11.84)
  Bottom Layer w0.254: v1(50.8,11.84) 50.8,6.89 51.56,6.12 R21.2
$1N2644: length 2.6
  Top Layer w0.254: 57.06,12.86 59.46,12.86 R23.2
$1N2646: length 12.5
  Top Layer w0.254: U6.1 59.32,26.39 59.32,18.81 59.58,18.55 R19.1
$1N2763: length 2
  Top Layer w0.254: PWR.2 51.63,22.07 R24.1
$1N4726: length 7.5
  Top Layer w0.254: R25.3 10.92,16.92 14.1,16.92 14.59,16.43 R5.1
$1N4783: length 37.5
  Top Layer w0.254: v1(13,7.39) 35.18,7.39 35.81,8.03 35.81,9.79 R9.1
  Bottom Layer w0.254: R26.2 v1(13,7.39)
$1N4874: length 7.5
  Top Layer w0.254: R27.3 36.29,20 38.1,18.19 R17.1
$1N4929: length 19.2
  Top Layer w0.254: v1(61.72,8.66) 61.72,10.02 R20.1
  Bottom Layer w0.254: R28.2 68.5,9.6 67.56,8.66 v1(61.72,8.66)
$1N5568: length 36.1
  Top Layer w0.254: R29.1 63.5,10.19 63.25,10.44 63.25,28.35 63.88,28.98 77.88,28.98 U7.1
$1N5570: length 14.6
  Top Layer w0.254: U8.2 75.06,13.24 75.56,12.73 75.56,7.9 77.34,6.12 R33.2
$1N5571: length 2.1
  Top Layer w0.254: LED5.2 68.67,12.86 R30.2
$1N5574: length 2.1
  Top Layer w0.254: R38.2 85.48,12.73 LED6.2
$1N5575: length 21.1
  Top Layer w0.254: U9.1 97.79,27.59 96.52,26.32 96.52,17.81 96.01,17.3 88.14,17.3 87.63,16.79 87.63,15.67 R34.1 87.38,15.52
$1N5578: length 18.8
  Top Layer w0.254: v1(76.96,11.08) 76.96,11.58 77.4,12.02 78.58,12.02 U8.6
  Bottom Layer w0.254: v1(76.96,11.08) 76.96,9.55 78.87,7.65 88.9,7.65 R36.2
$1N5589: length 27.6
  Top Layer w0.254: R32.1 64.55,17.46 65.41,18.32 87.82,18.32 R39.3
$1N5591: length 4.6
  Top Layer w0.254: R35.1 88.43,9.93 R40.2

## Copper pours and planes (outline as drawn; the poured copper is in the pictures)
GND on Top Layer: -28.45,57.43 103.12,57.43 103.12,-1.75 -28.45,-1.75
GND on Bottom Layer: -16,38.89 116.08,38.89 116.08,-5.05 -16,-5.05

Small or netless copper shapes (teardrops, artwork), in the pictures only: 205 on Top Layer, 42 on Bottom Layer

## Text on the board
Top Silkscreen Layer: A1 | A2 | A3 | A4 | A5 | A6 | VCC | GND | zzy
